# Altium project B100BA.PrjPcb (part 6 of 6)

## Sheet Real Time Clock.SchDoc: I2C Real Time Clock
size 393 x 281 mm; ApprovedBy: M. Günce Akkoyun; CheckedBy: M. Günce Akkoyun; Author: M. Günce Akkoyun; CompanyName: Ovoo Electronics; DrawnBy: M. Günce Akkoyun; Engineer: M. Günce Akkoyun; Organization: Ovoo Electronics; Address1: Necip Fazıl Mah. Ortaırmak Sok.; Address2: Birgül Apt. No: 19/6; Address3: Meram / Konya; Address4: Turkiye; DocumentNumber: 51; Revision: R01; SheetNumber: 40; SheetTotal: 44
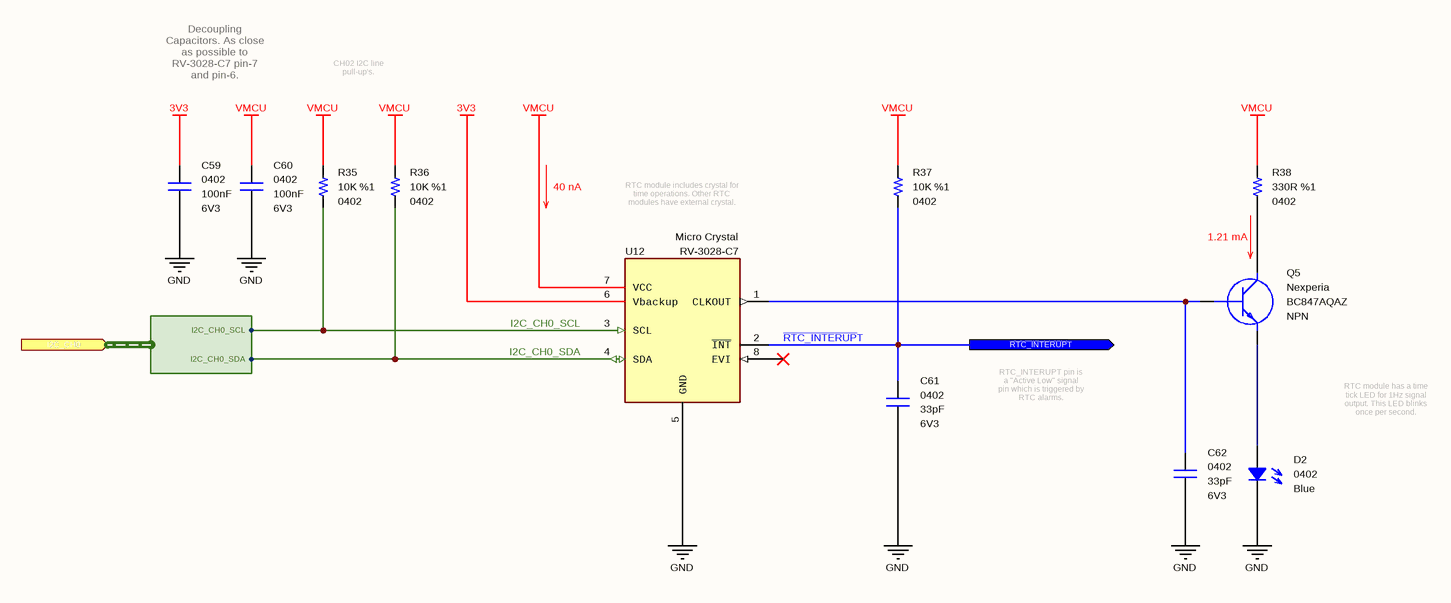
[diagram p39: Real Time Clock.SchDoc]

### Parts
C59  value 100nF  Case: 0402  Voltage: 6V3  [CAPACITOR_0402]  (hidden comment: Multilayer Ceramic Capacitor)
C60  value 100nF  Case: 0402  Voltage: 6V3  [CAPACITOR_0402]  (hidden comment: Multilayer Ceramic Capacitor)
C61  value 33pF  Case: 0402  Voltage: 6V3  [CAPACITOR_0402]  (hidden comment: Multilayer Ceramic Capacitor)
C62  value 33pF  Case: 0402  Voltage: 6V3  [CAPACITOR_0402]  (hidden comment: Multilayer Ceramic Capacitor)
D2  Case: 0402  Color: Blue  [LED_0402]  (hidden comment: SMD LED (Blue))
Q5  Polarity: NPN  Manufacturer Name: Nexperia  [SOT1215]  (hidden comment: BC847AQAZ)
R35  value 10K  Tolerance: %1  Case: 0402  [RESISTOR_0402]  (hidden comment: Thick Film Resistor)
R36  value 10K  Tolerance: %1  Case: 0402  [RESISTOR_0402]  (hidden comment: Thick Film Resistor)
R37  value 10K  Tolerance: %1  Case: 0402  [RESISTOR_0402]  (hidden comment: Thick Film Resistor)
R38  value 330R  Tolerance: %1  Case: 0402  [RESISTOR_0402]  (hidden comment: 330R - 0402 - %1 - 1/16W)
U12  Manufacturer Name: Micro Crystal  [RV-3028-C7]  (hidden comment: Real Time Clock)

### Ports
I2C_CH0 (in, harness I2C_CH0), ~{RTC_INTERUP}T (out)

### Harnesses
I2C_CH0: I2C_CH0_SDA, I2C_CH0_SCL

### Nets
3V3: C59.2 U12.6(Vbackup)
GND: C59.1 C60.1 C61.2 C62.2 D2.1 U12.5(GND)
VMCU: C60.2 R35.2 R36.2 R37.2 R38.2 U12.7(VCC)
~{RTC_INTERUP}T: C61.1 R37.1 U12.2(~{INT}) ; port ~{RTC_INTERUP}T
I2C_CH0_SCL: R35.1 U12.3(SCL) ; port I2C_CH0.I2C_CH0_SCL
I2C_CH0_SDA: R36.1 U12.4(SDA) ; port I2C_CH0.I2C_CH0_SDA
NetC62_1: C62.1 Q5.1(B) U12.1(CLKOUT)
NetD2_2: D2.2 Q5.2(E)
NetQ5_3: Q5.3(C) R38.1

Not connected (* = marked no-connect by the designer): U12 8(EVI)*

### Notes on the sheet
- Decoupling Capacitors. As close as possible to RV-3028-C7 pin-7 and pin-6.
- CH02 I2C line pull-up's.
- 40 nA
- RTC module includes crystal for time operations. Other RTC modules have external crystal.
- 1.21 mA
- RTC_INTERUPT pin is a "Active Low" signal pin which is triggered by RTC alarms.
- RTC module has a time tick LED for 1Hz signal output. This LED blinks once per second.
- © 2021 All rights reserved.
  This document may not, in whole or in part, be copied, photocopied, reproduced, translated or converted to any electronic or machine readable from without prior written permission of Mehmet Günce Akkoyun.
  Engineer contact : akkoyun@me.com
- Property of
- Engineer :
- Date :
- Size :
- A3
- Time :
- Project :
- Page :
- /
- Customer :
- Product ID :
- Module ID :
- Version :
- File :
- Revision :

### Library data of the parts
C59 C60 = Capacitor - 100nF [0402-6V3]: Capacitor - 100nF [0402-6V3] (Ceramic); Manufacturer Name: AVX; Manufacturer Part Number: 04026D104KAT4A; Dielectric: X5R; Tolerance: %10; Height: 0.25mm; ComponentLink1Description: Mouser; ComponentLink1URL: https://www.mouser.com.tr/ProductDetail/AVX/04026D104KAT4A?qs=sGAEpiMZZMs0AnBnWHyRQPg4iYkCw7IMED%2F4kpqgf7w%3D; ComponentLink2Description: DataSheet; ComponentLink2URL: https://www.mouser.com.tr/datasheet/2/40/cx5r-776519.pdf; ROHS: Yes; Maximum Operating Temperature: +85; Minimum Operating Temperature: -55; Supplier 1: Avnet; Supplier Part Number 1: 04026D104KAT4A; Mouser Part Number: 581-04026D104KAT4A
C61 C62 = Capacitor - 33pF [0402-6V3]: Capacitor - 33pF [0402] (Ceramic); Manufacturer Name: Kemet; Manufacturer Part Number: C0402C330J9RACAUTO; Dielectric: X7R; Tolerance: 10%; Height: 0.5mm; Maximum Operating Temperature: +125; Minimum Operating Temperature: -55; ROHS: Yes; ComponentLink1Description: DataSheet; ComponentLink1URL: https://api.kemet.com/component-edge/download/datasheet/C0402C330J9RACAUTO.pdf; ComponentLink2Description: Mouser; ComponentLink2URL: https://www.mouser.com/Search/Refine.aspx?Keyword=80-C0402C330J9RAUTO; Supplier 1: Mouser; Supplier Part Number 1: 80-C0402C330J9RAUTO; Mouser Part Number: 80-C0402C330J9RAUTO
D2 = Diode - LED (0402-Blue): Standard LEDs - SMD PICOLEDTM;BLUE LED; 25M @ 5MA; Manufacturer Name: ROHM Semiconductor; Manufacturer Part Number: SMLP13BC8TT86; ROHS: Yes; ComponentLink1Description: DataSheet; ComponentLink1URL: https://d1d2qsbl8m0m72.cloudfront.net/en/products/databook/datasheet/opto/led/chip_mono/sml-p1-e.pdf; ComponentLink2Description: Mouser; ComponentLink2URL: https://www.mouser.com.tr/ProductDetail/ROHM-Semiconductor/SMLP13BC8TT86?qs=%2Fha2pyFaduidYDgXFKL%252BNZwCVZNUI4FlyPWWbVDx1b6ABmzS%252BS2f0w%3D%3D; Supplier 1: Mouser; Supplier 2: Digi-Key; Supplier Part Number 1: 755-SMLP13BC8TT86; Supplier Part Number 2: 846-1112-1-ND; Mouser Part Number: 755-SMLP13BC8TT86
Q5 = Transistor - BC847: Bipolar NPN Transistors; Case: DFN-1010D-3; Supplier 1: Digi-Key; Supplier 2: Digi-Key; Supplier Part Number 1: 1727-2545-1-ND; Supplier Part Number 2: 1727-2545-6-ND; Manufacturer Part Number: BC847AQAZ; Supplier 3: Avnet; Supplier 4: Arrow Electronics; Supplier 5: Mouser; Supplier 6: Newark; Supplier 7: Digi-Key; Supplier 8: Farnell; Supplier 9: Farnell; Supplier Part Number 3: BC847AQAZ; Supplier Part Number 4: BC847AQAZ; Supplier Part Number 5: 771-BC847AQAZ; Supplier Part Number 6: 82Y6125; Supplier Part Number 7: 1727-2545-2-ND; Supplier Part Number 8: 2545344; Supplier Part Number 9: 2545344RL
R35-R37 = Resistor - 10K: Thick Film Resistors - SMD 1/16 W 10 Kohms 1%; Manufacturer Name: Vishay; Manufacturer Part Number: CRCW040210K0FKED; Height: 0.4mm; ComponentLink1Description: DataSheet; ComponentLink1URL: https://www.mouser.com.tr/datasheet/2/427/dcrcwe3-1762152.pdf; ComponentLink2Description: Mouser; ComponentLink2URL: https://www.mouser.com.tr/ProductDetail/Vishay-Dale/CRCW040210K0FKED?qs=sGAEpiMZZMu61qfTUdNhG2DpbjADlD3GcalbOv9utCY%3D; Supplier 1: Mouser; Supplier 2: Digi-Key; Supplier Part Number 1: 71-CRCW040210K0FKEDH; Supplier Part Number 2: 541-10.0KYCT-ND; Mouser Part Number: 71-CRCW0402-10K-E3
R38 = Resistor - 330R: Thick Film Resistors - SMD 1/16 W 330 Ohm 1%; Manufacturer Name: Vishay; Manufacturer Part Number: CRCW0402330RFKED; Height: 0.4mm; ComponentLink1Description: DataSheet; ComponentLink1URL: https://www.mouser.com.tr/datasheet/2/427/dcrcwe3-1762152.pdf; ComponentLink2Description: Mouser; ComponentLink2URL: https://www.mouser.com.tr/ProductDetail/Vishay-Dale/CRCW0402330RFKED?qs=sGAEpiMZZMu61qfTUdNhG2DpbjADlD3GGS6SwBlLi5Q%3D; Supplier 1: Digi-Key; Supplier 2: Digi-Key; Supplier Part Number 2: 541-330LDKR-ND; Supplier Part Number 1: 541-330LCT-ND; Mouser Part Number: 71-CRCW0402-330-E3; Supplier 3: Digi-Key; Supplier 4: Newark; Supplier 5: Newark; Supplier 6: RSComponents; Supplier 7: RSComponents; Supplier 8: Future Electronics; Supplier 9: Future Electronics; Supplier 10: Newark; Supplier 11: Newark; Supplier 12: Arrow Electronics; Supplier 13: Mouser; Supplier 14: Avnet; Supplier 15: Farnell; Supplier 16: Farnell; Supplier 17: Farnell; Supplier 18: Allied Electronics; Supplier 19: Allied Electronics; Supplier 20: Avnet; Supplier 21: Avnet; Supplier 22: Future Electronics; Supplier 23: Future Electronics; Supplier 24: Newark; Supplier 25: RSComponents; Supplier 26: RSComponents; Supplier Part Number 3: 541-330LTR-ND; Supplier Part Number 4: 52K6981; Supplier Part Number 5: 61M5301; Supplier Part Number 6: 6789178P; Supplier Part Number 7: 6789178; Supplier Part Number 9: 9848185; Supplier Part Number 8: 4103726; Supplier Part Number 10: 25AC7117; Supplier Part Number 11: 42K3473; Supplier Part Number 26: 1819488; Supplier Part Number 25: 1688408; Supplier Part Number 24: 24W2220; Supplier Part Number 23: CRCW0402330RFKED-REEL; Supplier Part Number 22: CRCW0402330RFKED-CUTT; Supplier Part Number 21: 52K6981; Supplier Part Number 20: 42K3473; Supplier Part Number 19: 70272759; Supplier Part Number 18: 70202255; Supplier Part Number 17: 1469709RL; Supplier Part Number 16: 2121540; Supplier Part Number 15: 1469709; Supplier Part Number 14: CRCW0402330RFKED; Supplier Part Number 13: 71-CRCW0402-330-E3; Supplier Part Number 12: CRCW0402330RFKED
U12 = IC - RV-3028-C7: Real Time Clock 32.768kHz I2C Time Acc. 1ppm; ComponentLink1Description: DataSheet; ComponentLink1URL: https://eu.mouser.com/datasheet/2/530/RV-3028-C7-1524919.pdf; ComponentLink2Description: Mouser; ComponentLink2URL: https://eu.mouser.com/ProductDetail/Micro-Crystal/RV-3028-C7-32768kHz-1ppm-TA-QC?qs=sGAEpiMZZMtpeOq%2F1QMb1b6mUOvJOzpDTOpQRtK3%252B9k%3D; Minimum Operating Temperature: -40; Maximum Operating Temperature: +85; Supplier 1: Digi-Key; Supplier Part Number 1: 2195-RV-3028-C732.768KHZ1PPM-TA-QCCT-ND; Case: SMD; Mouser Part Number: 428-203591-MG01; Manufacturer Part Number: RV-3028-C7

## Sheet Serial ID EEPROM.SchDoc: I2C Serial ID EEprom
size 292 x 193 mm; ApprovedBy: M. Günce Akkoyun; CheckedBy: M. Günce Akkoyun; Author: M. Günce Akkoyun; CompanyName: Ovoo Electronics; DrawnBy: M. Günce Akkoyun; Engineer: M. Günce Akkoyun; Organization: Ovoo Electronics; Address1: Necip Fazıl Mah. Ortaırmak Sok.; Address2: Birgül Apt. No: 19/6; Address3: Meram / Konya; Address4: Turkiye; DocumentNumber: 52; Revision: R01; SheetNumber: 40; SheetTotal: 42
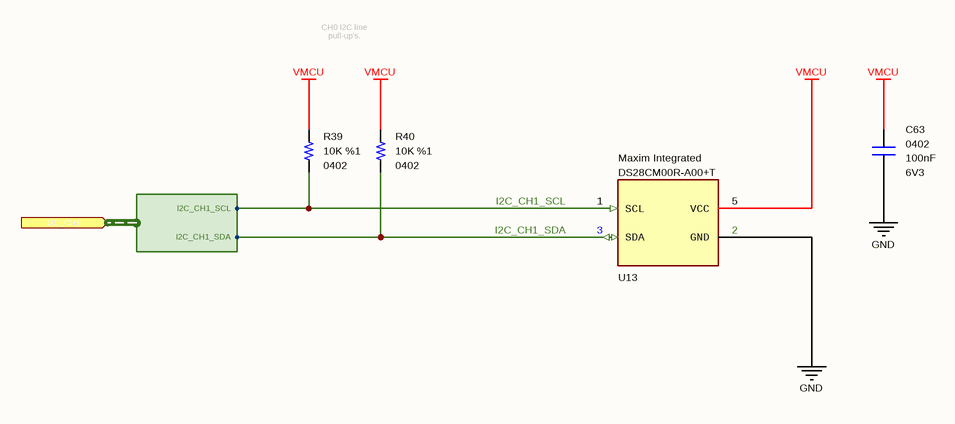
[diagram p40: Serial ID EEPROM.SchDoc]

### Parts
C63  value 100nF  Case: 0402  Voltage: 6V3  [CAPACITOR_0402]  (hidden comment: Multilayer Ceramic Capacitor)
R39  value 10K  Tolerance: %1  Case: 0402  [RESISTOR_0402]  (hidden comment: Thick Film Resistor)
R40  value 10K  Tolerance: %1  Case: 0402  [RESISTOR_0402]  (hidden comment: Thick Film Resistor)
U13  Manufacturer Part Number: DS28CM00R-A00+T  Manufacturer Name: Maxim Integrated  [SOT-23-5]  (hidden comment: Security ICs / Authentication ICs)

### Ports
I2C_CH1 (in, harness I2C_CH1)

### Harnesses
I2C_CH1: I2C_CH1_SDA, I2C_CH1_SCL

### Nets
GND: C63.1 U13.2(GND)
VMCU: C63.2 R39.2 R40.2 U13.5(VCC)
I2C_CH1_SCL: R39.1 U13.1(SCL) ; port I2C_CH1.I2C_CH1_SCL
I2C_CH1_SDA: R40.1 U13.3(SDA) ; port I2C_CH1.I2C_CH1_SDA

Not connected (* = marked no-connect by the designer): U13 4(NC)

### Notes on the sheet
- CH0 I2C line pull-up's.
- © 2021 All rights reserved.
  This document may not, in whole or in part, be copied, photocopied, reproduced, translated or converted to any electronic or machine readable from without prior written permission of Mehmet Günce Akkoyun.
  Engineer contact : akkoyun@me.com
- Property of
- Engineer :
- Date :
- Size :
- A4
- Time :
- Project :
- Page :
- /
- Customer :
- Product ID :
- Module ID :
- Version :
- File :
- Revision :

### Library data of the parts
C63 = Capacitor - 100nF [0402-6V3]: as C59 on sheet Real Time Clock; Height: 0.25mm; ComponentLink1Description: Mouser; ComponentLink1URL: https://www.mouser.com.tr/ProductDetail/AVX/04026D104KAT4A?qs=sGAEpiMZZMs0AnBnWHyRQPg4iYkCw7IMED%2F4kpqgf7w%3D; ComponentLink2Description: DataSheet; ComponentLink2URL: https://www.mouser.com.tr/datasheet/2/40/cx5r-776519.pdf; ROHS: Yes; Maximum Operating Temperature: +85; Minimum Operating Temperature: -55; Supplier 1: Avnet; Supplier Part Number 1: 04026D104KAT4A; Mouser Part Number: 581-04026D104KAT4A
R39 R40 = Resistor - 10K: as R35 on sheet Real Time Clock; Height: 0.4mm; ComponentLink1Description: DataSheet; ComponentLink1URL: https://www.mouser.com.tr/datasheet/2/427/dcrcwe3-1762152.pdf; ComponentLink2Description: Mouser; ComponentLink2URL: https://www.mouser.com.tr/ProductDetail/Vishay-Dale/CRCW040210K0FKED?qs=sGAEpiMZZMu61qfTUdNhG2DpbjADlD3GcalbOv9utCY%3D; Supplier 1: Mouser; Supplier 2: Digi-Key; Supplier Part Number 1: 71-CRCW040210K0FKEDH; Supplier Part Number 2: 541-10.0KYCT-ND; Mouser Part Number: 71-CRCW0402-10K-E3
U13 = IC - DS28CM00R-A00+T: Security ICs / Authentication ICs I C/SMBus Silicon Serial Number; Case: SOT-23-5; RoHS: Yes; ComponentLink1Description: DataSheet; ComponentLink1URL: https://www.mouser.com.tr/datasheet/2/256/DS28CM00-1514106.pdf; ComponentLink2Description: Mouser; ComponentLink2URL: https://www.mouser.com.tr/ProductDetail/Maxim-Integrated/DS28CM00R-A00%2bT/?qs=0Y9aZN%252BMVCUcpogu0Fss%2Fg%3D%3D; Supplier 1: RSComponents; Supplier 2: Mouser; Supplier 3: Future Electronics; Supplier 4: Farnell; Supplier 5: Newark; Supplier 6: Digi-Key; Supplier 7: Digi-Key; Supplier 8: Digi-Key; Supplier Part Number 1: 1904836; Supplier Part Number 2: 700-DS28CM00R-A00T; Supplier Part Number 4: 2514574; Supplier Part Number 5: 73Y1608; Supplier Part Number 6: DS28CM00R-A00+TCT-ND; Supplier Part Number 7: DS28CM00R-A00+TDKR-ND; Supplier Part Number 8: DS28CM00R-A00+TTR-ND; Supplier Part Number 3: 5092122; Mouser Part Number: 700-DS28CM00R-A00T

## Sheet EEPROM.SchDoc: I2C EEprom
size 292 x 193 mm; ApprovedBy: M. Günce Akkoyun; CheckedBy: M. Günce Akkoyun; Author: M. Günce Akkoyun; CompanyName: Ovoo Electronics; DrawnBy: M. Günce Akkoyun; Engineer: M. Günce Akkoyun; Organization: Ovoo Electronics; Address1: Necip Fazıl Mah. Ortaırmak Sok.; Address2: Birgül Apt. No: 19/6; Address3: Meram / Konya; Address4: Turkiye; DocumentNumber: 53; Revision: R01; SheetNumber: 42; SheetTotal: 44
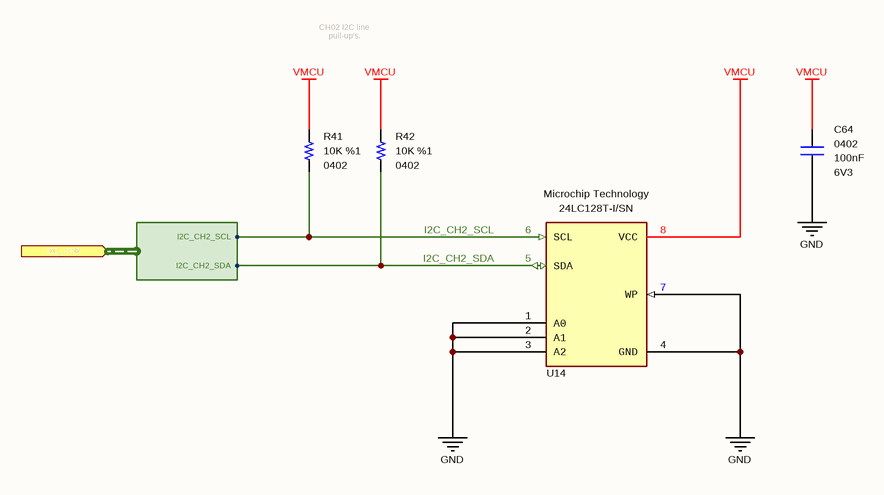
[diagram p41: EEPROM.SchDoc]

### Parts
C64  value 100nF  Case: 0402  Voltage: 6V3  [CAPACITOR_0402]  (hidden comment: Multilayer Ceramic Capacitor)
R41  value 10K  Tolerance: %1  Case: 0402  [RESISTOR_0402]  (hidden comment: Thick Film Resistor)
R42  value 10K  Tolerance: %1  Case: 0402  [RESISTOR_0402]  (hidden comment: Thick Film Resistor)
U14  Manufacturer Part Number: 24LC128T-I/SN  Manufacturer Name: Microchip Technology  [SOIC-8]  (hidden comment: EEPROM)

### Ports
I2C_CH2 (in, harness I2C_CH2)

### Harnesses
I2C_CH2: I2C_CH2_SDA, I2C_CH2_SCL

### Nets
GND: C64.1 U14.1(A0) U14.2(A1) U14.3(A2) U14.4(GND) U14.7(WP)
VMCU: C64.2 R41.2 R42.2 U14.8(VCC)
I2C_CH2_SCL: R41.1 U14.6(SCL) ; port I2C_CH2.I2C_CH2_SCL
I2C_CH2_SDA: R42.1 U14.5(SDA) ; port I2C_CH2.I2C_CH2_SDA

### Notes on the sheet
- CH02 I2C line pull-up's.
- © 2021 All rights reserved.
  This document may not, in whole or in part, be copied, photocopied, reproduced, translated or converted to any electronic or machine readable from without prior written permission of Mehmet Günce Akkoyun.
  Engineer contact : akkoyun@me.com
- Property of
- Engineer :
- Date :
- Size :
- A4
- Time :
- Project :
- Page :
- /
- Customer :
- Product ID :
- Module ID :
- Version :
- File :
- Revision :

### Library data of the parts
C64 = Capacitor - 100nF [0402-6V3]: as C59 on sheet Real Time Clock; Height: 0.25mm; ComponentLink1Description: Mouser; ComponentLink1URL: https://www.mouser.com.tr/ProductDetail/AVX/04026D104KAT4A?qs=sGAEpiMZZMs0AnBnWHyRQPg4iYkCw7IMED%2F4kpqgf7w%3D; ComponentLink2Description: DataSheet; ComponentLink2URL: https://www.mouser.com.tr/datasheet/2/40/cx5r-776519.pdf; ROHS: Yes; Maximum Operating Temperature: +85; Minimum Operating Temperature: -55; Supplier 1: Avnet; Supplier Part Number 1: 04026D104KAT4A; Mouser Part Number: 581-04026D104KAT4A
R41 R42 = Resistor - 10K: as R35 on sheet Real Time Clock; Height: 0.4mm; ComponentLink1Description: DataSheet; ComponentLink1URL: https://www.mouser.com.tr/datasheet/2/427/dcrcwe3-1762152.pdf; ComponentLink2Description: Mouser; ComponentLink2URL: https://www.mouser.com.tr/ProductDetail/Vishay-Dale/CRCW040210K0FKED?qs=sGAEpiMZZMu61qfTUdNhG2DpbjADlD3GcalbOv9utCY%3D; Supplier 1: Mouser; Supplier 2: Digi-Key; Supplier Part Number 1: 71-CRCW040210K0FKEDH; Supplier Part Number 2: 541-10.0KYCT-ND; Mouser Part Number: 71-CRCW0402-10K-E3
U14 = IC - 24LC128: Case: SOIC-8; RoHS: Yes; ComponentLink1Description: DataSheet; ComponentLink1URL: https://www.mouser.com.tr/datasheet/2/256/DS28CM00-1514106.pdf; ComponentLink2Description: Mouser; ComponentLink2URL: https://www.mouser.com.tr/ProductDetail/Maxim-Integrated/DS28CM00R-A00%2bT/?qs=0Y9aZN%252BMVCUcpogu0Fss%2Fg%3D%3D; Mouser Part Number: 579-24LC128T-I/SN; Supplier 1: Avnet; Supplier 2: Future Electronics; Supplier 3: Arrow Electronics; Supplier 4: Mouser; Supplier 5: Farnell; Supplier 6: Newark; Supplier 7: Digi-Key; Supplier 8: Digi-Key; Supplier Part Number 1: 24LC128T-I/SN; Supplier Part Number 2: 4391603; Supplier Part Number 3: 24LC128T-I/SN; Supplier Part Number 4: 579-24LC128T-I/SN; Supplier Part Number 5: 1296574; Supplier Part Number 6: 25M1950; Supplier Part Number 7: 24LC128T-I/SNCT-ND; Supplier Part Number 8: 24LC128T-I/SNDKR-ND

## Sheet Analog Digital Converter.SchDoc: Analog Digital Converter
size 292 x 193 mm; ApprovedBy: M. Günce Akkoyun; CheckedBy: M. Günce Akkoyun; Author: M. Günce Akkoyun; CompanyName: Ovoo Electronics; DrawnBy: M. Günce Akkoyun; Engineer: M. Günce Akkoyun; Organization: Ovoo Electronics; Address1: Necip Fazıl Mah. Ortaırmak Sok.; Address2: Birgül Apt. No: 19/6; Address3: Meram / Konya; Address4: Turkiye; DocumentNumber: 54; Revision: R01; SheetNumber: 42; SheetTotal: 42
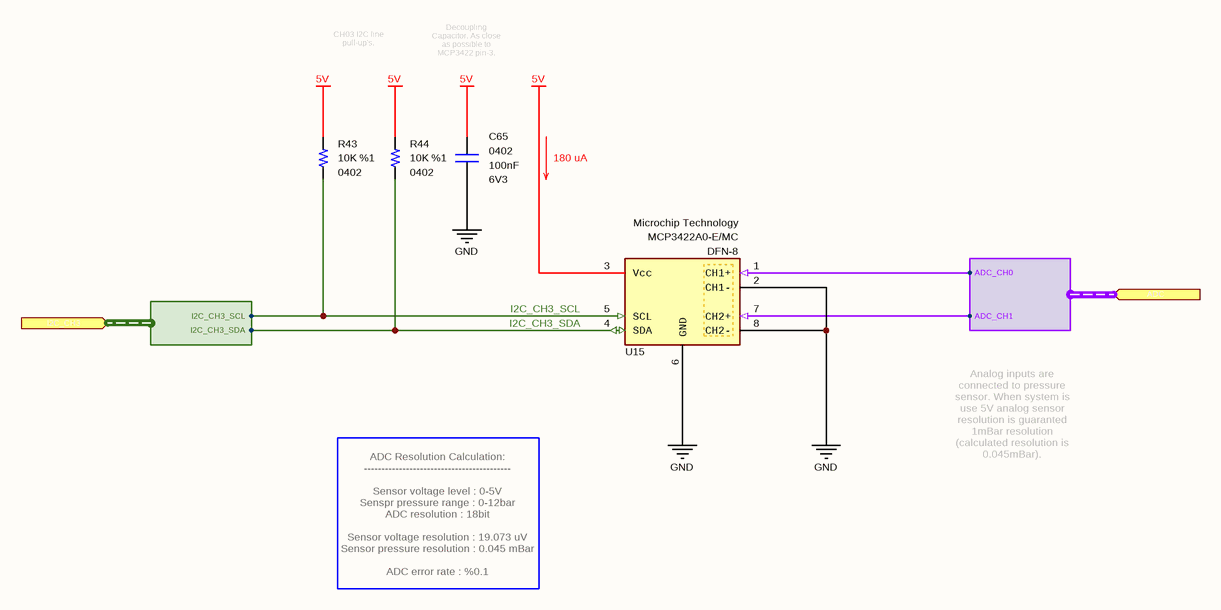
[diagram p42: Analog Digital Converter.SchDoc]

### Parts
C65  value 100nF  Case: 0402  Voltage: 6V3  [CAPACITOR_0402]  (hidden comment: Multilayer Ceramic Capacitor)
R43  value 10K  Tolerance: %1  Case: 0402  [RESISTOR_0402]  (hidden comment: Thick Film Resistor)
R44  value 10K  Tolerance: %1  Case: 0402  [RESISTOR_0402]  (hidden comment: Thick Film Resistor)
U15  Manufacturer Part Number: MCP3422A0-E/MC  Manufacturer Name: Microchip Technology  [DFN-8]  (hidden comment: Analog to Digital Converters - ADC)

### Ports
ADC (in, harness ADC), I2C_CH3 (in, harness I2C_CH3)

### Harnesses
I2C_CH3: I2C_CH3_SDA, I2C_CH3_SCL
ADC: ADC_CH0, ADC_CH1

### Nets
5V: C65.2 R43.2 R44.2 U15.3(Vcc)
GND: C65.1 U15.2(CH1-) U15.6(GND) U15.8(CH2-)
ADC.ADC_CH0: U15.1(CH1+) ; port ADC.ADC_CH0
ADC.ADC_CH1: U15.7(CH2+) ; port ADC.ADC_CH1
I2C_CH3_SCL: R43.1 U15.5(SCL) ; port I2C_CH3.I2C_CH3_SCL
I2C_CH3_SDA: R44.1 U15.4(SDA) ; port I2C_CH3.I2C_CH3_SDA

### Notes on the sheet
- CH03 I2C line pull-up's.
- Decoupling Capacitor. As close as possible to MCP3422 pin-3.
- 180 uA
- Analog inputs are connected to pressure sensor. When system is use 5V analog sensor resolution is guaranted 1mBar resolution (calculated resolution is 0.045mBar).
- ADC Resolution Calculation:
  ------------------------------------------
  Sensor voltage level : 0-5V
  Senspr pressure range : 0-12bar
  ADC resolution : 18bit
  Sensor voltage resolution : 19.073 uV
  Sensor pressure resolution : 0.045 mBar
  ADC error rate : %0.1
- © 2021 All rights reserved.
  This document may not, in whole or in part, be copied, photocopied, reproduced, translated or converted to any electronic or machine readable from without prior written permission of Mehmet Günce Akkoyun.
  Engineer contact : akkoyun@me.com
- Property of
- Engineer :
- Date :
- Size :
- A4
- Time :
- Project :
- Page :
- /
- Customer :
- Product ID :
- Module ID :
- Version :
- File :
- Revision :

### Library data of the parts
C65 = Capacitor - 100nF [0402-6V3]: as C59 on sheet Real Time Clock; Height: 0.25mm; ComponentLink1Description: Mouser; ComponentLink1URL: https://www.mouser.com.tr/ProductDetail/AVX/04026D104KAT4A?qs=sGAEpiMZZMs0AnBnWHyRQPg4iYkCw7IMED%2F4kpqgf7w%3D; ComponentLink2Description: DataSheet; ComponentLink2URL: https://www.mouser.com.tr/datasheet/2/40/cx5r-776519.pdf; ROHS: Yes; Maximum Operating Temperature: +85; Minimum Operating Temperature: -55; Supplier 1: Avnet; Supplier Part Number 1: 04026D104KAT4A; Mouser Part Number: 581-04026D104KAT4A
R43 R44 = Resistor - 10K: as R35 on sheet Real Time Clock; Height: 0.4mm; ComponentLink1Description: DataSheet; ComponentLink1URL: https://www.mouser.com.tr/datasheet/2/427/dcrcwe3-1762152.pdf; ComponentLink2Description: Mouser; ComponentLink2URL: https://www.mouser.com.tr/ProductDetail/Vishay-Dale/CRCW040210K0FKED?qs=sGAEpiMZZMu61qfTUdNhG2DpbjADlD3GcalbOv9utCY%3D; Supplier 1: Mouser; Supplier 2: Digi-Key; Supplier Part Number 1: 71-CRCW040210K0FKEDH; Supplier Part Number 2: 541-10.0KYCT-ND; Mouser Part Number: 71-CRCW0402-10K-E3
U15 = IC - MCP3422: Analog to Digital Converters - ADC 18B delta-sigma ADC dual Ch 4sps; ComponentLink1Description: DataSheet; ComponentLink1URL: http://www.ti.com/general/docs/suppproductinfo.tsp?distId=26&gotoUrl=http%3A%2F%2Fwww.ti.com%2Flit%2Fgpn%2Ftca9517a; ComponentLink2Description: Mouser; ComponentLink2URL: https://www.mouser.com.tr/ProductDetail/Texas-Instruments/TCA9517ADGKR?qs=%252BrH4t%252BeVZ2M4pVnwXR4oNA==; Minimum Operating Temperature: -40; Maximum Operating Temperature: +125; Supplier 1: Avnet; Supplier 2: Mouser; Supplier 3: Arrow; Supplier 4: Digi-Key; Supplier Part Number 1: MCP3422A0-E/MC; Supplier Part Number 2: 579-MCP3422A0-E/MC; Supplier Part Number 3: MCP3422A0-E/MC; Supplier Part Number 4: MCP3422A0-E/MC-ND; Case: DFN-8; Mouser Part Number: 579-MCP3422A0-E/MC

## Sheet Module Output Connector.SchDoc: Module Output Connector
size 292 x 193 mm; SheetNumber: 44; SheetTotal: 44
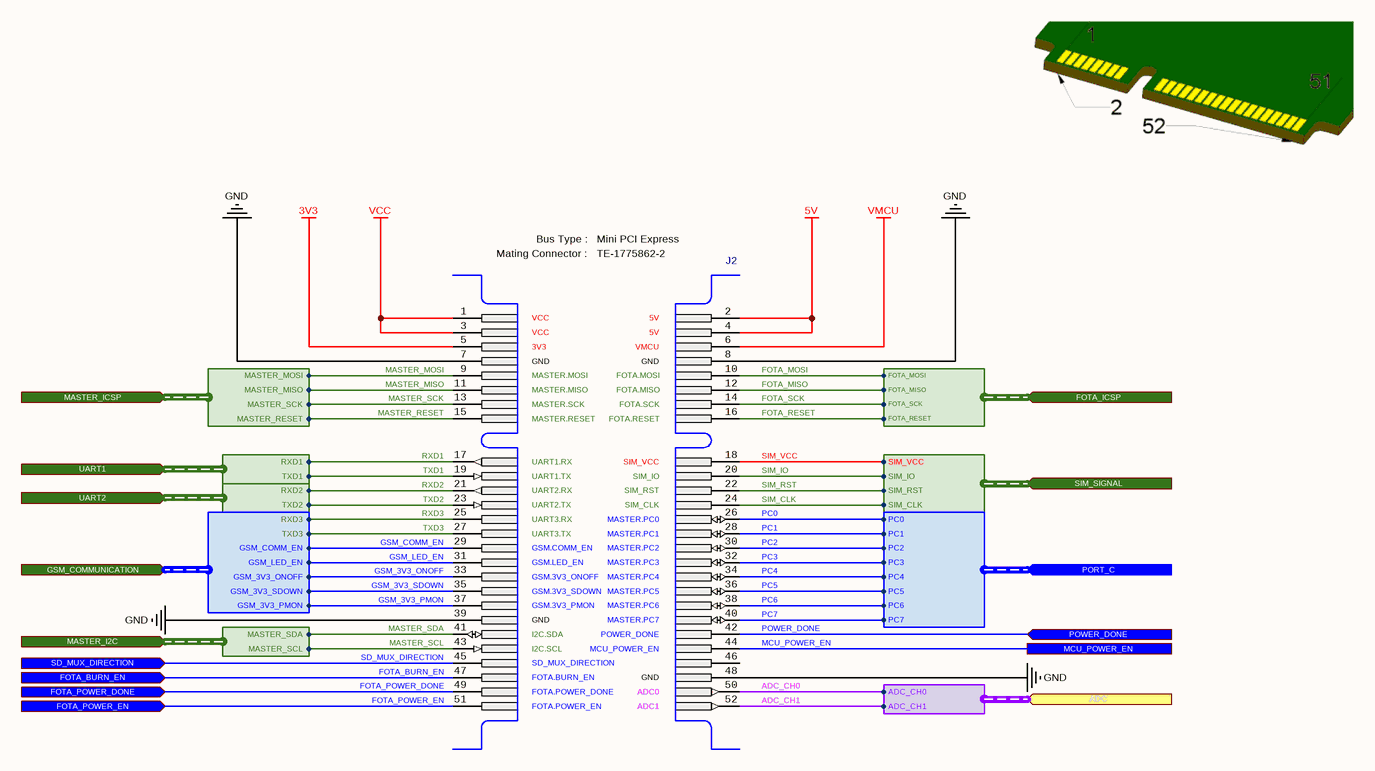
[diagram p43: Module Output Connector.SchDoc]

### Parts
J2  BUS Type: Mini PCI Express  Mating Connector: TE-1775862-2  [PCB - Mini PCI Express]  (hidden comment: Mini PCI Express Gold Finger)  (net tie, no BOM)

### Ports
ADC (in, harness ADC), FOTA_BURN_EN (in), FOTA_ICSP (in, harness FOTA_ICSP), FOTA_POWER_DONE (in), FOTA_POWER_EN (in), GSM_COMMUNICATION (in, harness GSM_COMMUNICATION), MASTER_I2C (in, harness MASTER_I2C), MASTER_ICSP (in, harness MASTER_ICSP), MCU_POWER_EN, PORT_C (in, harness PORT_C), POWER_DONE (in), SD_MUX_DIRECTION (in), SIM_SIGNAL (in, harness SIM_SIGNAL), UART1 (in, harness UART1), UART2 (in, harness UART2)

### Harnesses
SIM_SIGNAL: SIM_VCC, SIM_IO, SIM_RST, SIM_CLK
FOTA_ICSP: FOTA_MOSI, FOTA_MISO, FOTA_SCK, FOTA_RESET
ADC: ADC_CH0, ADC_CH1
MASTER_ICSP: MASTER_MOSI, MASTER_MISO, MASTER_SCK, MASTER_RESET
UART1: RXD1, TXD1
UART2: RXD2, TXD2
GSM_COMMUNICATION: GSM_3V3_ONOFF, GSM_LED_EN, GSM_COMM_EN, GSM_3V3_SDOWN, GSM_3V3_PMON, RXD3, TXD3
PORT_C: PC0, PC1, PC2, PC3, PC4, PC5, PC7, PC6
MASTER_I2C: MASTER_SCL, MASTER_SDA

### Nets
3V3: J2.5(Pin-5)
5V: J2.2(Pin-2) J2.4(Pin-4)
GND: J2.7(Pin-7) J2.8(Pin-8) J2.39(Pin-39) J2.48(Pin-48)
VCC: J2.1(Pin-1) J2.3(Pin-3)
VMCU: J2.6(Pin-6)
ADC_CH0: J2.50(Pin-50) ; port ADC.ADC_CH0  [project net ADC.ADC_CH0]
ADC_CH1: J2.52(Pin-52) ; port ADC.ADC_CH1  [project net ADC.ADC_CH1]
FOTA_BURN_EN: J2.47(Pin-47) ; port FOTA_BURN_EN
FOTA_MISO: J2.12(Pin-12) ; port FOTA_ICSP.FOTA_MISO  [project net FOTA_ICSP.FOTA_MISO]
FOTA_MOSI: J2.10(Pin-10) ; port FOTA_ICSP.FOTA_MOSI  [project net FOTA_ICSP.FOTA_MOSI]
FOTA_POWER_DONE: J2.49(Pin-49) ; port FOTA_POWER_DONE
FOTA_POWER_EN: J2.51(Pin-51) ; port FOTA_POWER_EN
FOTA_RESET: J2.16(Pin-16) ; port FOTA_ICSP.FOTA_RESET  [project net FOTA_ICSP.FOTA_RESET]
FOTA_SCK: J2.14(Pin-14) ; port FOTA_ICSP.FOTA_SCK  [project net FOTA_ICSP.FOTA_SCK]
GSM_3V3_ONOFF: J2.33(Pin-33) ; port GSM_COMMUNICATION.GSM_3V3_ONOFF
GSM_3V3_PMON: J2.37(Pin-37) ; port GSM_COMMUNICATION.GSM_3V3_PMON
GSM_3V3_SDOWN: J2.35(Pin-35) ; port GSM_COMMUNICATION.GSM_3V3_SDOWN
GSM_COMM_EN: J2.29(Pin-29) ; port GSM_COMMUNICATION.GSM_COMM_EN  [project net GSM_3V3_COMM_EN]
GSM_LED_EN: J2.31(Pin-31) ; port GSM_COMMUNICATION.GSM_LED_EN  [project net GSM_3V3_LED_EN]
MASTER_MISO: J2.11(Pin-11) ; port MASTER_ICSP.MASTER_MISO  [project net MASTER_ICSP.MASTER_MISO]
MASTER_MOSI: J2.9(Pin-9) ; port MASTER_ICSP.MASTER_MOSI  [project net MASTER_ICSP.MASTER_MOSI]
MASTER_RESET: J2.15(Pin-15) ; port MASTER_ICSP.MASTER_RESET  [project net MASTER_ICSP.MASTER_RESET]
MASTER_SCK: J2.13(Pin-13) ; port MASTER_ICSP.MASTER_SCK  [project net MASTER_ICSP.MASTER_SCK]
MASTER_SCL: J2.43(Pin-43) ; port MASTER_I2C.MASTER_SCL  [project net MASTER_I2C.MASTER_SCL]
MASTER_SDA: J2.41(Pin-41) ; port MASTER_I2C.MASTER_SDA  [project net MASTER_I2C.MASTER_SDA]
MCU_POWER_EN: J2.44(Pin-44) ; port MCU_POWER_EN
PC0: J2.26(Pin-26) ; port PORT_C.PC0
PC1: J2.28(Pin-28) ; port PORT_C.PC1
PC2: J2.30(Pin-30) ; port PORT_C.PC2
PC3: J2.32(Pin-32) ; port PORT_C.PC3
PC4: J2.34(Pin-34) ; port PORT_C.PC4
PC5: J2.36(Pin-36) ; port PORT_C.PC5
PC6: J2.38(Pin-38) ; port PORT_C.PC6
PC7: J2.40(Pin-40) ; port PORT_C.PC7
POWER_DONE: J2.42(Pin-42) ; port POWER_DONE
RXD1: J2.17(Pin-17) ; port UART1.RXD1
RXD2: J2.21(Pin-21) ; port UART2.RXD2
RXD3: J2.25(Pin-25) ; port GSM_COMMUNICATION.RXD3  [project net GSM_3V3_TX]
SD_MUX_DIRECTION: J2.45(Pin-45) ; port SD_MUX_DIRECTION
SIM_CLK: J2.24(Pin-24) ; port SIM_SIGNAL.SIM_CLK
SIM_IO: J2.20(Pin-20) ; port SIM_SIGNAL.SIM_IO
SIM_RST: J2.22(Pin-22) ; port SIM_SIGNAL.SIM_RST
SIM_VCC: J2.18(Pin-18) ; port SIM_SIGNAL.SIM_VCC  [project net SIM_SIGNAL.SIM_VCC]
TXD1: J2.19(Pin-19) ; port UART1.TXD1
TXD2: J2.23(Pin-23) ; port UART2.TXD2
TXD3: J2.27(Pin-27) ; port GSM_COMMUNICATION.TXD3  [project net GSM_3V3_RX]

Not connected (* = marked no-connect by the designer): J2 46(Pin-46)

### Notes on the sheet
- (near J2) VCC
- (near J2) 5V
- (near J2) 3V3
- (near J2) GND
- (near J2) MASTER.MOSI
- (near J2) MASTER.MISO
- (near J2) VMCU
- (near J2) FOTA.MOSI
- (near J2) FOTA.MISO
- (near J2) MASTER.SCK
- (near J2) MASTER.RESET
- (near J2) UART1.RX
- (near J2) FOTA.SCK
- (near J2) FOTA.RESET
- (near J2) SIM_VCC
- (near J2) UART1.TX
- (near J2) UART2.RX
- (near J2) UART2.TX
- (near J2) UART3.RX
- (near J2) UART3.TX
- (near J2) SIM_IO
- (near J2) SIM_RST
- (near J2) SIM_CLK
- (near J2) MASTER.PC0
- (near J2) MASTER.PC1
- (near J2) GSM.COMM_EN
- (near J2) GSM.LED_EN
- (near J2) GSM.3V3_ONOFF
- (near J2) GSM.3V3_SDOWN
- (near J2) GSM.3V3_PMON
- (near J2) MASTER.PC2
- (near J2) MASTER.PC3
- (near J2) MASTER.PC4
- (near J2) MASTER.PC5
- (near J2) MASTER.PC6
- (near J2) I2C.SDA
- (near J2) I2C.SCL
- (near J2) SD_MUX_DIRECTION
- (near J2) FOTA.BURN_EN
- (near J2) MASTER.PC7
- (near J2) POWER_DONE
- (near J2) MCU_POWER_EN
- (near J2) FOTA.POWER_DONE
- (near J2) FOTA.POWER_EN
- (near J2) ADC0
- (near J2) ADC1
- © 2021 All rights reserved.
  This document may not, in whole or in part, be copied, photocopied, reproduced, translated or converted to any electronic or machine readable from without prior written permission of Mehmet Günce Akkoyun.
  Engineer contact : akkoyun@me.com
- Property of
- Engineer :
- Date :
- Size :
- A4
- Time :
- Project :
- Page :
- /
- Customer :
- Product ID :
- Module ID :
- Version :
- File :
- Revision :
- (in symbol PCB - Mini PCI Express & MSATA) Bus Type :; Mating Connector :

### Library data of the parts
J2 = PCB - Mini PCI Express & MSATA: Number of Positions: 52; Pitch: 0.8 mm; ComponentLink1Description: DataSheet; ComponentLink1URL: https://fit-iot.s3.amazonaws.com/download/facet-cards/documents/PCI_Express_miniCard_Electromechanical_specs_rev1.2.pdf

## Sheet Serial to USB Converter.SchDoc: UART0 Serial to USB Converter
size 393 x 281 mm; SheetNumber: 43; SheetTotal: 44
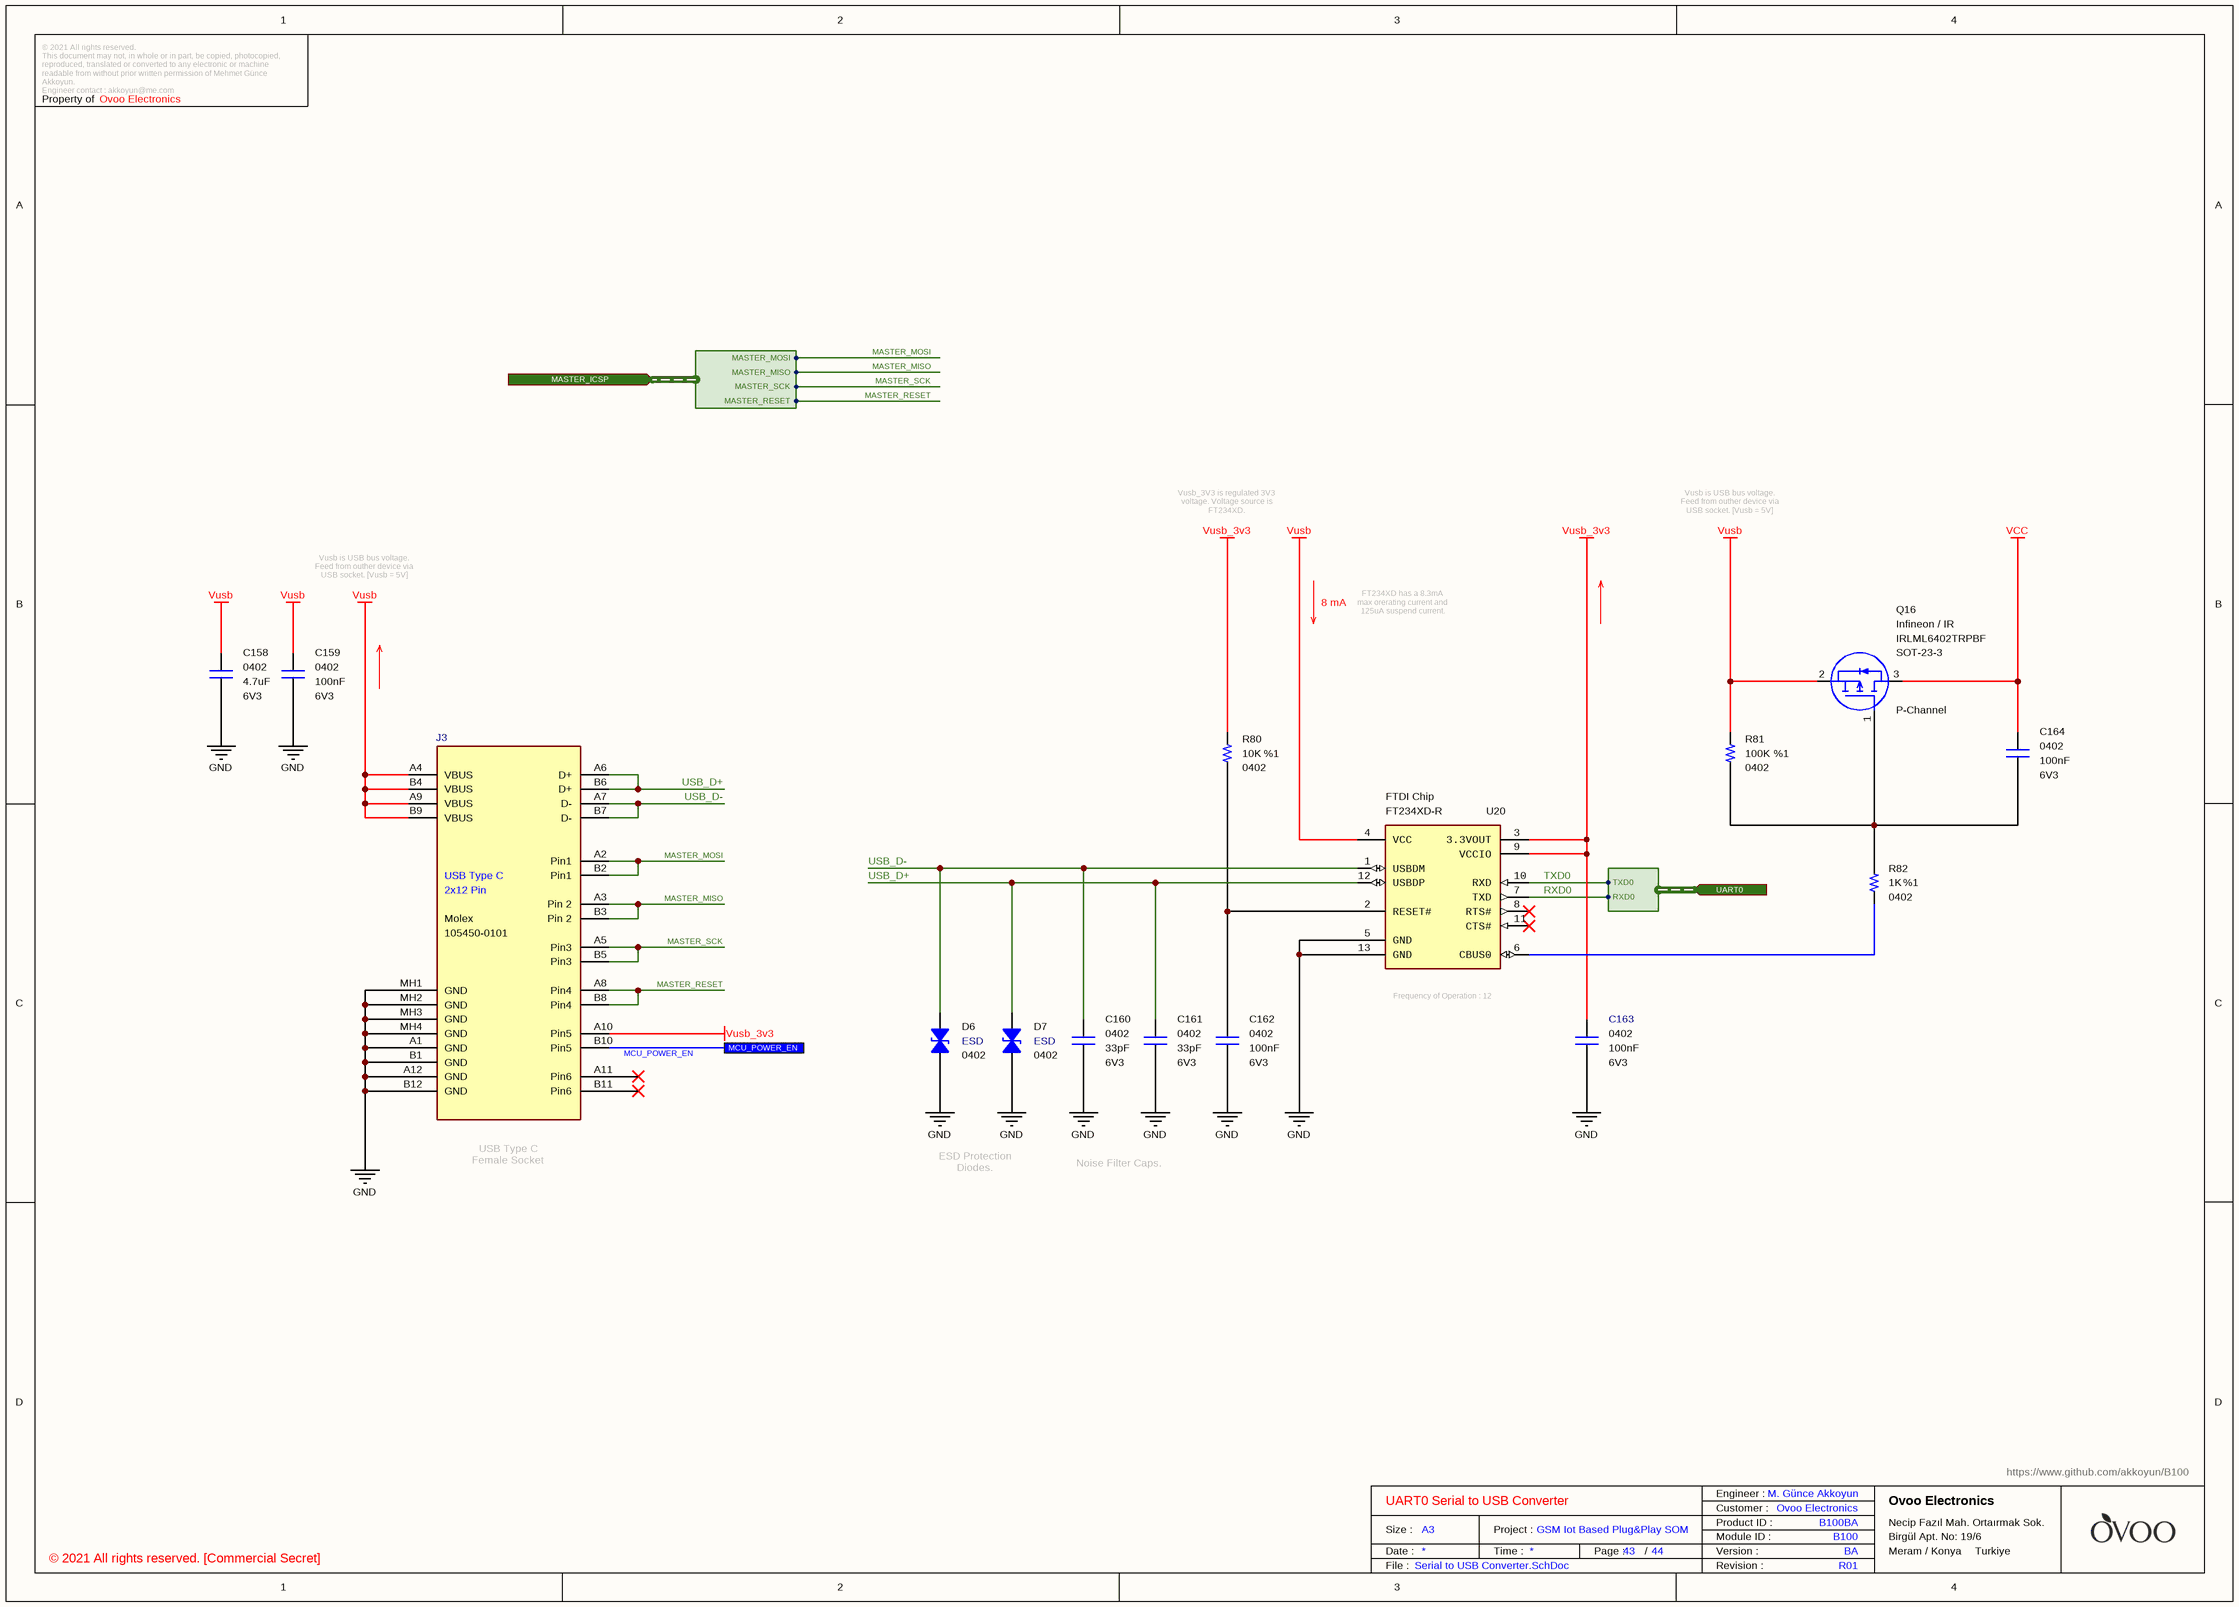
[diagram p44: Serial to USB Converter.SchDoc]

### Parts
C158  value 4.7uF  Case: 0402  Voltage: 6V3  [CAPACITOR_0402]  (hidden comment: Multilayer Ceramic Capacitor)
C159  value 100nF  Case: 0402  Voltage: 6V3  [CAPACITOR_0402]  (hidden comment: Multilayer Ceramic Capacitor)
C160  value 33pF  Case: 0402  Voltage: 6V3  [CAPACITOR_0402]  (hidden comment: Multilayer Ceramic Capacitor)
C161  value 33pF  Case: 0402  Voltage: 6V3  [CAPACITOR_0402]  (hidden comment: Multilayer Ceramic Capacitor)
C162  value 100nF  Case: 0402  Voltage: 6V3  [CAPACITOR_0402]  (hidden comment: Multilayer Ceramic Capacitor)
C163  value 100nF  Case: 0402  Voltage: 6V3  [CAPACITOR_0402]  (hidden comment: Multilayer Ceramic Capacitor)
C164  value 100nF  Case: 0402  Voltage: 6V3  [CAPACITOR_0402]  (hidden comment: Multilayer Ceramic Capacitor)
D6  Case: 0402  [ESD_0402]  (hidden comment: ESD Suppressors)
D7  Case: 0402  [ESD_0402]  (hidden comment: ESD Suppressors)
J3  Manufacturer Part Number: 105450-0101  Manufacturer Name: Molex  [USB Type C - Molex 105450-0101]  (hidden comment: USB Type C SMD Connector)
Q16  Transistor Polarity: P-Channel  Manufacturer Part Number: IRLML6402TRPBF  Manufacturer Name: Infineon / IR  [SOT-23-3]  (hidden comment: P-Channel MosFET)
R80  value 10K  Tolerance: %1  Case: 0402  [RESISTOR_0402]  (hidden comment: Thick Film Resistor)
R81  value 100K  Tolerance: %1  Case: 0402  [RESISTOR_0402]  (hidden comment: Thick Film Resistor)
R82  value 1K  Tolerance: %1  Case: 0402  [RESISTOR_0402]  (hidden comment: Thick Film Resistor)
U20  Manufacturer Part Number: FT234XD-R  Manufacturer Name: FTDI Chip  [DFN-12]  (hidden comment: USB/UART IC)

### Ports
MASTER_ICSP (in, harness MASTER_ICSP), MCU_POWER_EN, UART0 (in, harness UART0)

### Harnesses
UART0: RXD0, TXD0
MASTER_ICSP: MASTER_MOSI, MASTER_MISO, MASTER_SCK, MASTER_RESET

### Nets
GND: C158.1 C159.1 C160.2 C161.2 C162.2 C163.2 D6.1 D7.1 J3.A1(GND) J3.A12(GND) J3.B1(GND) J3.B12(GND) J3.MH1(GND) J3.MH2(GND) J3.MH3(GND) J3.MH4(GND) U20.5(GND) U20.13(GND)
VCC: C164.2 Q16.3(D)
Vusb: C158.2 C159.2 J3.A4(VBUS) J3.A9(VBUS) J3.B4(VBUS) J3.B9(VBUS) Q16.2(S) R81.2 U20.4(VCC)
Vusb_3v3: C163.1 J3.A10(Pin5) R80.2 U20.3(3.3VOUT) U20.9(VCCIO)
MASTER_MISO: J3.A3(Pin_2) J3.B3(Pin_2) ; port MASTER_ICSP.MASTER_MISO  [project net MASTER_ICSP.MASTER_MISO]
MASTER_MOSI: J3.A2(Pin1) J3.B2(Pin1) ; port MASTER_ICSP.MASTER_MOSI  [project net MASTER_ICSP.MASTER_MOSI]
MASTER_RESET: J3.A8(Pin4) J3.B8(Pin4) ; port MASTER_ICSP.MASTER_RESET  [project net MASTER_ICSP.MASTER_RESET]
MASTER_SCK: J3.A5(Pin3) J3.B5(Pin3) ; port MASTER_ICSP.MASTER_SCK  [project net MASTER_ICSP.MASTER_SCK]
MCU_POWER_EN: J3.B10(Pin5) ; port MCU_POWER_EN
RXD0: U20.7(TXD) ; port UART0.RXD0
TXD0: U20.10(RXD) ; port UART0.TXD0
USB_D+: C161.1 D7.2 J3.A6(D+) J3.B6(D+) U20.12(USBDP)
USB_D-: C160.1 D6.2 J3.A7(D-) J3.B7(D-) U20.1(USBDM)
NetC162_1: C162.1 R80.1 U20.2(RESET#)
NetC164_1: C164.1 Q16.1(G) R81.1 R82.2
NetR82_1: R82.1 U20.6(CBUS0)

Not connected (* = marked no-connect by the designer): J3 A11(Pin6)* B11(Pin6)*; U20 8(RTS#)* 11(CTS#)*

### Notes on the sheet
- Vusb_3V3 is regulated 3V3 voltage. Voltage source is FT234XD.
- Vusb is USB bus voltage. Feed from outher device via USB socket. [Vusb = 5V]
- 8 mA
- FT234XD has a 8.3mA max orerating current and 125uA suspend current.
- (near U20) Frequency of Operation : 12 MHz
- (near J3) USB Type C
  Female Socket
- ESD Protection Diodes.
- Noise Filter Caps.
- © 2021 All rights reserved.
  This document may not, in whole or in part, be copied, photocopied, reproduced, translated or converted to any electronic or machine readable from without prior written permission of Mehmet Günce Akkoyun.
  Engineer contact : akkoyun@me.com
- Property of
- Engineer :
- Date :
- Size :
- A3
- Time :
- Project :
- Page :
- /
- Customer :
- Product ID :
- Module ID :
- Version :
- File :
- Revision :
- (in symbol Connector - USB Type C) USB Type C; 2x12 Pin
- (in symbol Diode - ESD Protection) ESD

### Library data of the parts
C158 = Capacitor - 4.7uF [0402-6V3]: Capacitor - 4.7uF [0402] (Ceramic); Manufacturer Name: Kemet; Manufacturer Part Number: C0402C475M9PACTU; Dielectric: X5R; Tolerance: %20; Height: 0.5mm; ComponentLink1Description: Mouser; ComponentLink1URL: https://www.mouser.com.tr/ProductDetail/KEMET/C0402C475M9PACTU?qs=x4XeXhDQKnr0GX0Xu9DUoQ==; ComponentLink2Description: DataSheet; ComponentLink2URL: https://www.mouser.com.tr/datasheet/2/40/cx5r-776519.pdf; ROHS: Yes; Maximum Operating Temperature: +85; Minimum Operating Temperature: -55; Supplier 1: Mouser; Supplier 2: Arrow; Supplier 3: Farnell; Supplier 4: Digi-Key; Supplier Part Number 1: 80-C0402C475M9P; Supplier Part Number 2: C0402C475M9PACTU; Supplier Part Number 3: 2750760; Supplier Part Number 4: 399-13068-1-ND; Mouser Part Number: 80-C0402C475M9P
C159 C162-C164 = Capacitor - 100nF [0402-6V3]: as C59 on sheet Real Time Clock; Height: 0.25mm; ComponentLink1Description: Mouser; ComponentLink1URL: https://www.mouser.com.tr/ProductDetail/AVX/04026D104KAT4A?qs=sGAEpiMZZMs0AnBnWHyRQPg4iYkCw7IMED%2F4kpqgf7w%3D; ComponentLink2Description: DataSheet; ComponentLink2URL: https://www.mouser.com.tr/datasheet/2/40/cx5r-776519.pdf; ROHS: Yes; Maximum Operating Temperature: +85; Minimum Operating Temperature: -55; Supplier 1: Avnet; Supplier Part Number 1: 04026D104KAT4A; Mouser Part Number: 581-04026D104KAT4A
C160 C161 = Capacitor - 33pF [0402-6V3]: as C61 on sheet Real Time Clock; Height: 0.5mm; Maximum Operating Temperature: +125; Minimum Operating Temperature: -55; ROHS: Yes; ComponentLink1Description: DataSheet; ComponentLink1URL: https://api.kemet.com/component-edge/download/datasheet/C0402C330J9RACAUTO.pdf; ComponentLink2Description: Mouser; ComponentLink2URL: https://www.mouser.com/Search/Refine.aspx?Keyword=80-C0402C330J9RAUTO; Supplier 1: Mouser; Supplier Part Number 1: 80-C0402C330J9RAUTO; Mouser Part Number: 80-C0402C330J9RAUTO
D6 D7 = Diode - ESD Protection: TVS Diode (Bi-directional); Manufacturer Part Number: 0402ESDA-MLP1; Manufacturer Name: Bussmann / Eaton; Clamping Voltage: 35V; Diode Capacitance: 0.05pF; Polarity: Bidirectional; Voltage ESD Air Gap: 15kV; Voltage ESD Contact: 8kV; Working Voltage: 30V; Height: 0.436mm; Maximum Operating Temperature: +125; Minimum Operating Temperature: -55; ROHS: Yes; ComponentLink1Description: DataSheet; ComponentLink1URL: https://www.mouser.com.tr/datasheet/2/87/47c59e11-d058-4882-bc35-d8572f2ca054-38826.pdf; ComponentLink2Description: Mouser; ComponentLink2URL: https://www.mouser.com.tr/ProductDetail/Bussmann-Eaton/0402ESDA-MLP1?qs=%2Fha2pyFadughxyc7TyLWeW%2FUvipVY6Ex3naV%2FjpO3plZBZWDLqV4bw%3D%3D; Supplier 1: Mouser; Supplier 2: Digi-Key; Supplier Part Number 2: 283-2964-1-ND; Supplier Part Number 1: 504-0402ESDA-MLP1; Mouser Part Number: 504-0402ESDA-MLP1
J3 = Connector - USB Type C: USB Connectors USB Type C Recep R/A TOPMNT GLD Flash; Contact: 24; ROHS: Yes; ComponentLink1Description: DataSheet; ComponentLink1URL: https://www.mouser.com.tr/datasheet/2/276/1/1054500101_IO_CONNECTORS-1373915.pdf; ComponentLink2Description: Mouser; ComponentLink2URL: https://www.mouser.com.tr/ProductDetail/Molex/105450-0101?qs=%2Fha2pyFaduilhIhGrcOnZKIbgAc75siexx3a9CswCkZ6hpfCuwF0Ig%3D%3D; Case: SMD; ComponentLink3Description: Drawing; ComponentLink3URL: https://www.molex.com/pdm_docs/sd/1054500101_sd.pdf; ComponentLink4Description: Product Page; ComponentLink4URL: https://www.molex.com/molex/products/part-detail/io_connectors/1054500101; Supplier 1: Digi-Key; Supplier 2: Digi-Key; Supplier 3: Digi-Key; Supplier 4: Newark; Supplier 5: Newark; Supplier 6: Avnet; Supplier 7: Avnet; Supplier 8: RSComponents; Supplier 9: RSComponents; Supplier 10: Mouser; Supplier 11: Arrow Electronics; Supplier 12: Allied Electronics; Supplier 13: Farnell; Supplier Part Number 1: WM12856CT-ND; Supplier Part Number 2: WM12856DKR-ND; Supplier Part Number 3: WM12856TR-ND; Supplier Part Number 4: 33AC7773; Supplier Part Number 6: 33AC7773; Supplier Part Number 5: 02AH5567; Supplier Part Number 7: 02AH5567; Supplier Part Number 8: 9209199P; Supplier Part Number 9: 9209199; Supplier Part Number 10: 538-105450-0101; Supplier Part Number 11: 105450-0101; Supplier Part Number 12: 70799721; Supplier Part Number 13: 2524076
Q16 = Transistor - IRLML6402TRPBF: MOSFET MOSFT P-Ch -3.7A 65mOhm 8nC Log Lvl; Vds: 20 V; Id: 3.7 A; Vgs th: 4 V; Rds On: 65 mOhms; Vgs: 12 V; ComponentLink1Description: Mouser; ComponentLink1URL: https://www.mouser.com.tr/ProductDetail/Infineon-IR/IRLML6402TRPBF?qs=9%252BKlkBgLFf0HuZuONx2Ewg%3D%3D; ComponentLink2Description: DataSheet; ComponentLink2URL: https://www.mouser.com.tr/datasheet/2/196/irlml6402pbf-1732951.pdf; Maximum Operating Temperature: +150; Minimum Operating Temperature: -55; Supplier 1: Newark; Supplier 2: Avnet; Supplier 3: RSComponents; Supplier 4: Farnell; Supplier Part Number 1: 97K2355; Supplier Part Number 2: 97K2355; Supplier Part Number 3: 0301322; Supplier Part Number 4: 9103503; Case: SOT-23-3
R80 = Resistor - 10K: as R35 on sheet Real Time Clock; Height: 0.4mm; ComponentLink1Description: DataSheet; ComponentLink1URL: https://www.mouser.com.tr/datasheet/2/427/dcrcwe3-1762152.pdf; ComponentLink2Description: Mouser; ComponentLink2URL: https://www.mouser.com.tr/ProductDetail/Vishay-Dale/CRCW040210K0FKED?qs=sGAEpiMZZMu61qfTUdNhG2DpbjADlD3GcalbOv9utCY%3D; Supplier 1: Mouser; Supplier 2: Digi-Key; Supplier Part Number 1: 71-CRCW040210K0FKEDH; Supplier Part Number 2: 541-10.0KYCT-ND; Mouser Part Number: 71-CRCW0402-10K-E3
R81 = Resistor - 100K: Thick Film Resistors - SMD 1/16 W 100 Kohms 1%; Manufacturer Name: Vishay; Manufacturer Part Number: CRCW0402100KFKED; Height: 0.35mm; Mouser Part Number: 71-CRCW0402-100K-E3; ComponentLink1Description: DataSheet; ComponentLink1URL: https://www.mouser.com.tr/datasheet/2/427/dcrcwe3-1762152.pdf; ComponentLink2Description: Mouser; ComponentLink2URL: https://eu.mouser.com/ProductDetail/Vishay-Dale/CRCW0402100KFKED?qs=OlqPY1CiralZGKRwQ4Glcg%3D%3D; Supplier 1: Future Electronics; Supplier 2: Future Electronics; Supplier 3: Arrow; Supplier 4: Farnell; Supplier 5: Digi-Key; Supplier Part Number 1: CRCW0402100KFKED-CUTT; Supplier Part Number 2: CRCW0402100KFKED-REEL; Supplier Part Number 3: CRCW0402100KFKED; Supplier Part Number 4: 2121857; Supplier Part Number 5: 541-100KLCT-ND
R82 = Resistor - 1K: Thick Film Resistors - SMD 1/16 W 1.0 Kohms 1%; Manufacturer Name: Vishay; Manufacturer Part Number: CRCW04021K00FKED; Height: 0.35mm; Mouser Part Number: 71-CRCW0402-1.0K-E3; ComponentLink1Description: DataSheet; ComponentLink1URL: https://www.mouser.com.tr/datasheet/2/427/dcrcwe3-1762152.pdf; ComponentLink2Description: Mouser; ComponentLink2URL: https://www.mouser.com.tr/ProductDetail/Vishay-Dale/CRCW04021K00FKED?qs=sGAEpiMZZMu61qfTUdNhG2DpbjADlD3GFJ4zSbeLqG8%3D; Supplier 1: Mouser; Supplier 2: Digi-Key; Supplier Part Number 1: 71-CRCW0402-1.0K-E3; Supplier Part Number 2: 541-1.00KLCT-ND
U20 = IC - FT234XD-R: Height: 0.75mm; Mouser Part Number: 895-FT234XD-R; ComponentLink1Description: DataSheet; ComponentLink1URL: https://componentsearchengine.com/Datasheets/2/FT234XD-R.pdf; ComponentLink2Description: Mouser; ComponentLink2URL: https://www.mouser.com/Search/Refine.aspx?Keyword=895-FT234XD-R; Supplier 1: Mouser; Supplier 2: Arrow; Supplier 3: Farnell; Supplier 4: Newark; Supplier 5: Digi-Key; Supplier Part Number 1: 895-FT234XD-R; Supplier Part Number 2: FT234XD-R; Supplier Part Number 3: 2419911; Supplier Part Number 4: 53X3171; Supplier Part Number 5: 768-1178-1-ND

## Nets that join several sheets
3V3: Main Power Switch (C3.1 JP1.2 R83.2 U1.1), 3V3 LDO Regulator (C5.1 C6.2 C7.1 FB3.2), Real Time Clock (C59.2 U12.6), Module Output Connector (J2.5)
5V: 5V Buck Boost Converter (9 pins), 3V3 LDO Regulator (C4.1 U2.1 U2.3), Analog Digital Converter (C65.2 R43.2 R44.2 U15.3), Module Output Connector (J2.2 J2.4)
GND: 3V8 Buck Boost Converter (21 pins), 5V Buck Boost Converter (13 pins), Main Power Switch (7 pins), 3V3 LDO Regulator (5 pins), GSM Modem Core (40 pins), GSM eSIM (6 pins), GSM Modem Antenna (5 pins), GSM On-Off Control (C104.2 Q10.2 R67.1), GSM SDown Control (C105.2 Q11.2 R69.1), Bidirectional Voltage Translator (15 pins), GSM LED Driver (12 pins), Master MicroController Port C (8 pins), Master MicroController Core (13 pins), SD Card (7 pins), Buzzer (10 pins), Master MicroController LED (14 pins), FOTA MicroController Core (10 pins), FOTA LED Driver (14 pins), FOTA MicroController Power Switch (10 pins), FOTA Burn Buffer (5 pins), I2C Multiplexer (5 pins), Real Time Clock (6 pins), Serial ID EEPROM (C63.1 U13.2), EEPROM (6 pins), Analog Digital Converter (C65.1 U15.2 U15.6 U15.8), Module Output Connector (J2.7 J2.8 J2.39 J2.48), Serial to USB Converter (18 pins)
VCC: 3V8 Buck Boost Converter (6 pins), 5V Buck Boost Converter (7 pins), Module Output Connector (J2.1 J2.3), Serial to USB Converter (C164.2 Q16.3)
VFOTA: FOTA MicroController Core (7 pins), FOTA LED Driver (C94.1 Q6.2 R52.2), FOTA MicroController Power Switch (R7.1 U5.6), FOTA Burn Buffer (C33.2 U8.19)
VIOT1: 3V8 Buck Boost Converter (C75.1 C76.2 C77.2 FB1.2), GSM Modem Core (U18.M01 U18.M02)
VIOT2: 3V8 Buck Boost Converter (C80.1 C81.2 C82.2 FB2.2), GSM Modem Core (U18.N01 U18.N02 U18.P01 U18.P02)
VMCU: Main Power Switch (C1.1 R1.1 U1.6), Bidirectional Voltage Translator (5 pins), GSM LED Driver (C107.1 Q12.2 R70.2), Master MicroController Core (10 pins), SD Card (8 pins), Buzzer (C36.2 U9.12), Master MicroController LED (C51.1 Q1.2 R22.2), FOTA MicroController Power Switch (C20.2 C21.1 U4.1 U5.1), FOTA Burn Buffer (C34.2 U8.2), I2C Multiplexer (5 pins), Real Time Clock (6 pins), Serial ID EEPROM (C63.2 R39.2 R40.2 U13.5), EEPROM (C64.2 R41.2 R42.2 U14.8), Module Output Connector (J2.6)
2G_ANTENNA: GSM Modem Core (U18.K01), GSM Modem Antenna (C102.2 L3.2 R65.2)
~{RTC_INTERUP}T: Master MicroController Port E (U10.7), Real Time Clock (C61.1 R37.1 U12.2)
ADC.ADC_CH0: Analog Digital Converter (U15.1), Module Output Connector (J2.50)
ADC.ADC_CH1: Analog Digital Converter (U15.7), Module Output Connector (J2.52)
BUZZER_EN_1: Master MicroController Port B (U10.25), Buzzer (C38.2 R18.2 U9.1)
BUZZER_EN_2: Master MicroController Port B (U10.26), Buzzer (C39.2 R19.2 U9.2)
BUZZER_PWM: Master MicroController Port B (U10.24), Buzzer (C40.2 R20.2 U9.3)
DIGITAL_ICSP.DIGITAL_MISO: FOTA MicroController Core (U6.30), FOTA Burn Buffer (U8.18)
DIGITAL_ICSP.DIGITAL_MOSI: FOTA MicroController Core (U6.31), FOTA Burn Buffer (U8.16)
DIGITAL_ICSP.DIGITAL_RESET: FOTA MicroController Core (U6.1), FOTA Burn Buffer (U8.12)
DIGITAL_ICSP.DIGITAL_SCK: FOTA MicroController Core (U6.32), FOTA Burn Buffer (U8.14)
FOTA_BURN_EN: FOTA MicroController Core (U6.13), FOTA Burn Buffer (C35.1 R17.2 U8.10), Module Output Connector (J2.47)
FOTA_ICSP.FOTA_MISO: SD Card (U7.5), FOTA MicroController Core (U6.16), Module Output Connector (J2.12)
FOTA_ICSP.FOTA_MOSI: SD Card (U7.2), FOTA MicroController Core (U6.15), Module Output Connector (J2.10)
FOTA_ICSP.FOTA_RESET: FOTA MicroController Core (C29.2 R11.1 U6.29), Module Output Connector (J2.16)
FOTA_ICSP.FOTA_SCK: SD Card (U7.11), FOTA MicroController Core (U6.17), Module Output Connector (J2.14)
FOTA_LED_BLUE: FOTA MicroController Core (U6.26), FOTA LED Driver (R59.2)
FOTA_LED_EN: FOTA MicroController Core (U6.23), FOTA LED Driver (R53.2)
FOTA_LED_GREEN: FOTA MicroController Core (U6.25), FOTA LED Driver (R58.2)
FOTA_LED_RED: FOTA MicroController Core (U6.24), FOTA LED Driver (R57.2)
FOTA_POWER_DONE: FOTA MicroController Core (U6.12), FOTA MicroController Power Switch (C22.2 R9.2 U4.4), Module Output Connector (J2.49)
FOTA_POWER_EN: Master MicroController Port E (U10.5), FOTA MicroController Power Switch (R8.2 U4.3), Module Output Connector (J2.51)
FOTA_SPI.FOTA_SS: SD Card (U7.14), FOTA MicroController Core (U6.14)
GSM_1V8_ONOFF: GSM Modem Core (U18.R12), GSM On-Off Control (Q10.3)
GSM_1V8_PMON: GSM Modem Core (C101.2 U18.R11), Bidirectional Voltage Translator (C15.2 C19.2 U3.10 U3.16)
GSM_1V8_RX: GSM Modem Core (U18.N15), Bidirectional Voltage Translator (C18.2 U3.13)
GSM_1V8_SDOWN: GSM Modem Core (U18.R13), GSM SDown Control (Q11.3)
GSM_1V8_STAT: GSM Modem Core (U18.C08), GSM LED Driver (R76.2)
GSM_1V8_TX: GSM Modem Core (U18.M15), Bidirectional Voltage Translator (C16.2 U3.11)
GSM_1V8_TXMON: GSM Modem Core (U18.B14), GSM LED Driver (R77.2)
GSM_3V3_COMM_EN: Bidirectional Voltage Translator (C14.2 R5.1 U3.14 U3.15), Master MicroController Port H (U10.15), Module Output Connector (J2.29)
GSM_3V3_LED_EN: GSM LED Driver (R71.2), Master MicroController Port H (U10.16), Module Output Connector (J2.31)
GSM_3V3_ONOFF: GSM On-Off Control (R66.2), Master MicroController Port H (U10.17), Module Output Connector (J2.33)
GSM_3V3_PMON: Bidirectional Voltage Translator (C10.2 R6.2 U3.7), GSM LED Driver (R75.2), Master MicroController Port H (U10.27), Module Output Connector (J2.37)
GSM_3V3_RX: Bidirectional Voltage Translator (C13.2 U3.4), Master MicroController Core (U10.64), Module Output Connector (J2.27)
GSM_3V3_SDOWN: GSM SDown Control (R68.2), Master MicroController Port H (U10.18), Module Output Connector (J2.35)
GSM_3V3_TX: Bidirectional Voltage Translator (C11.2 U3.6), Master MicroController Core (U10.63), Module Output Connector (J2.25)
GSM_POWER_EN: 3V8 Buck Boost Converter (C78.2 R47.2 U16.12), Master MicroController Port H (U10.14)
I2C_CH0_SCL: I2C Multiplexer (U11.5), Real Time Clock (R35.1 U12.3)
I2C_CH0_SDA: I2C Multiplexer (U11.4), Real Time Clock (R36.1 U12.4)
I2C_CH1_SCL: I2C Multiplexer (U11.7), Serial ID EEPROM (R39.1 U13.1)
I2C_CH1_SDA: I2C Multiplexer (U11.6), Serial ID EEPROM (R40.1 U13.3)
I2C_CH2_SCL: I2C Multiplexer (U11.10), EEPROM (R41.1 U14.6)
I2C_CH2_SDA: I2C Multiplexer (U11.9), EEPROM (R42.1 U14.5)
I2C_CH3_SCL: I2C Multiplexer (U11.12), Analog Digital Converter (R43.1 U15.5)
I2C_CH3_SDA: I2C Multiplexer (U11.11), Analog Digital Converter (R44.1 U15.4)
MASTER_I2C.MASTER_SCL: Master MicroController Core (U10.43), I2C Multiplexer (R33.1 U11.14), Module Output Connector (J2.43)
MASTER_I2C.MASTER_SDA: Master MicroController Core (U10.44), I2C Multiplexer (R34.1 U11.15), Module Output Connector (J2.41)
MASTER_ICSP.MASTER_MISO: Master MicroController Core (U10.22), SD Card (U7.6), FOTA Burn Buffer (U8.3), Module Output Connector (J2.11), Serial to USB Converter (J3.A3 J3.B3)
MASTER_ICSP.MASTER_MOSI: Master MicroController Core (U10.21), SD Card (U7.3), FOTA Burn Buffer (U8.5), Module Output Connector (J2.9), Serial to USB Converter (J3.A2 J3.B2)
MASTER_ICSP.MASTER_RESET: Master MicroController Core (C49.2 R21.1 U10.30), FOTA Burn Buffer (U8.9), Module Output Connector (J2.15), Serial to USB Converter (J3.A8 J3.B8)
MASTER_ICSP.MASTER_SCK: Master MicroController Core (U10.20), SD Card (U7.10), FOTA Burn Buffer (U8.7), Module Output Connector (J2.13), Serial to USB Converter (J3.A5 J3.B5)
MASTER_SPI.MASTER_SS: Master MicroController Core (U10.19), SD Card (U7.13)
MCU_LED_BLUE: Master MicroController Port D (U10.50), Master MicroController LED (R29.2)
MCU_LED_EN: Master MicroController Port D (U10.47), Master MicroController LED (R23.2)
MCU_LED_GREEN: Master MicroController Port D (U10.49), Master MicroController LED (R28.2)
MCU_LED_RED: Master MicroController Port D (U10.48), Master MicroController LED (R27.2)
MCU_POWER_EN: Main Power Switch (6 pins), Module Output Connector (J2.44), Serial to USB Converter (J3.B10)
PC0: Master MicroController Port C (C126.2 U10.53), Module Output Connector (J2.26)
PC1: Master MicroController Port C (C127.2 U10.54), Module Output Connector (J2.28)
PC2: Master MicroController Port C (C128.2 U10.55), Module Output Connector (J2.30)
PC3: Master MicroController Port C (C129.2 U10.56), Module Output Connector (J2.32)
PC4: Master MicroController Port C (C130.2 U10.57), Module Output Connector (J2.34)
PC5: Master MicroController Port C (C131.2 U10.58), Module Output Connector (J2.36)
PC6: Master MicroController Port C (C132.2 U10.59), Module Output Connector (J2.38)
PC7: Master MicroController Port C (C133.2 U10.60), Module Output Connector (J2.40)
POWER_DONE: Master MicroController Port E (U10.8), Module Output Connector (J2.42)
RXD0: Master MicroController Core (U10.2), Serial to USB Converter (U20.7)
RXD1: Master MicroController Core (U10.45), Module Output Connector (J2.17)
RXD2: Master MicroController Core (U10.12), Module Output Connector (J2.21)
SD_MUX_DIRECTION: Master MicroController Port E (U10.4), SD Card (C32.2 R16.2 U7.1), Module Output Connector (J2.45)
SIM_CLK: GSM Modem Core (U18.A06), GSM eSIM (C114.2 U19.6), Module Output Connector (J2.24)
SIM_IO: GSM Modem Core (U18.A05), GSM eSIM (C113.2 U19.3), Module Output Connector (J2.20)
SIM_RST: GSM Modem Core (U18.A07), GSM eSIM (C115.2 U19.7), Module Output Connector (J2.22)
SIM_SIGNAL.SIM_VCC: GSM Modem Core (U18.A03), GSM eSIM (C116.2 C117.2 U19.8), Module Output Connector (J2.18)
TXD0: Master MicroController Core (U10.3), Serial to USB Converter (U20.10)
TXD1: Master MicroController Core (U10.46), Module Output Connector (J2.19)
TXD2: Master MicroController Core (U10.13), Module Output Connector (J2.23)

## Assembly variants
Prototype: all parts fitted
Bulk: not fitted C62 D2 D4 Q5 R38